# EAGLE design Motor Powerboard Schematic 1A (EAGLE 8.3.2)
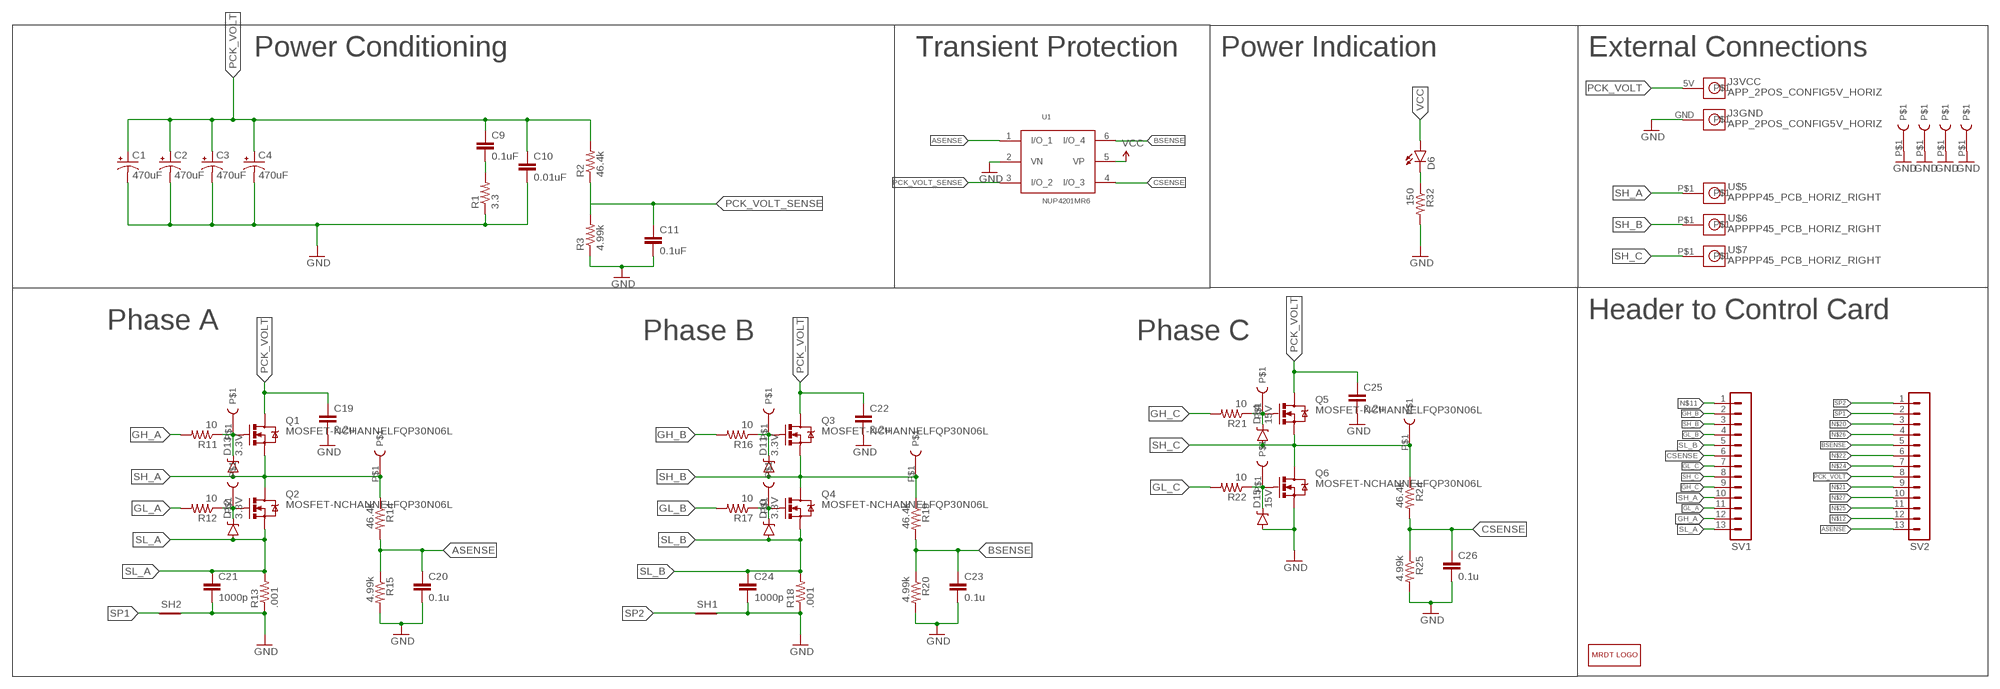
[diagram p0: schematic, sheet 1]

## Parts
C1  470uF  CAP_POLPTH4  [CPOL-RADIAL-1000UF-25V]
C2  470uF  CAP_POLPTH4  [CPOL-RADIAL-1000UF-25V]
C3  470uF  CAP_POLPTH4  [CPOL-RADIAL-1000UF-25V]
C4  470uF  CAP_POLPTH4  [CPOL-RADIAL-1000UF-25V]
C9  0.1uF  CAP0805  [0805]
C10  0.01uF  CAP0805  [0805]
C11  0.1uF  CAP0805  [0805]
C19  2.2u  CAP1206  [1206]
C20  0.1u  CAP0805  [0805]
C21  1000p  CAP0805  [0805]
C22  2.2u  CAP1206  [1206]
C23  0.1u  CAP0805  [0805]
C24  1000p  CAP0805  [0805]
C25  2.2u  CAP1206  [1206]
C26  0.1u  CAP0805  [0805]
D6  LED1206  [LED-1206]
D10  3.3V  DIODE-ZENER3.3V  [SOD-323]
D11  3.3V  DIODE-ZENER3.3V  [SOD-323]
D12  3.3V  DIODE-ZENER3.3V  [SOD-323]
D13  3.3V  DIODE-ZENER3.3V  [SOD-323]
D14  15V  DIODE-ZENER3.3V  [SOD-323]
D15  15V  DIODE-ZENER3.3V  [SOD-323]
J3  APP_2POS_CONFIG5V_HORIZ  [APP45_5V_HORIZ_CONFIG]
LOGO1  MRDT_LOGO  [MRDT_LOGO]
Q1  MOSFET-NCHANNELFQP30N06L  [TO220V]
Q2  MOSFET-NCHANNELFQP30N06L  [TO220V]
Q3  MOSFET-NCHANNELFQP30N06L  [TO220V]
Q4  MOSFET-NCHANNELFQP30N06L  [TO220V]
Q5  MOSFET-NCHANNELFQP30N06L  [TO220V]
Q6  MOSFET-NCHANNELFQP30N06L  [TO220V]
R1  3.3  RESISTOR1206  [1206]
R2  46.4k  RESISTOR0805-RES  [0805]
R3  4.99k  RESISTOR0805-RES  [0805]
R11  10  RESISTOR0805-RES  [0805]
R12  10  RESISTOR0805-RES  [0805]
R13  .001  RESISTOR1206  [1206]
R14  46.4k  RESISTOR0805-RES  [0805]
R15  4.99k  RESISTOR0805-RES  [0805]
R16  10  RESISTOR0805-RES  [0805]
R17  10  RESISTOR0805-RES  [0805]
R18  .001  RESISTOR1206  [1206]
R19  46.4k  RESISTOR0805-RES  [0805]
R20  4.99k  RESISTOR0805-RES  [0805]
R21  10  RESISTOR0805-RES  [0805]
R22  10  RESISTOR0805-RES  [0805]
R24  46.4k  RESISTOR0805-RES  [0805]
R25  4.99k  RESISTOR0805-RES  [0805]
R32  150  RESISTOR0805-RES  [0805]
SH1  SHORT-HT5  [SHORT_TOP-50]
SH2  SHORT-HT5  [SHORT_TOP-50]
SV1  MA13-1  [MA13-1]
SV2  MA13-1  [MA13-1]
U1  NUP4201MR6  [TSOP-6]
U$5  APPPP45_PCB_HORIZ_RIGHT  [APP45_PCB_HORIZ_RIGHT]
U$6  APPPP45_PCB_HORIZ_RIGHT  [APP45_PCB_HORIZ_RIGHT]
U$7  APPPP45_PCB_HORIZ_RIGHT  [APP45_PCB_HORIZ_RIGHT]
U$12  TEST_POINT_0.1INDIAM  [TEST_POINT_0.1INDIAM]
U$15  TEST_POINT_0.1INDIAM  [TEST_POINT_0.1INDIAM]
U$16  TEST_POINT_0.1INDIAM  [TEST_POINT_0.1INDIAM]
U$17  TEST_POINT_0.1INDIAM  [TEST_POINT_0.1INDIAM]
U$18  TEST_POINT_0.1INDIAM  [TEST_POINT_0.1INDIAM]
U$19  TEST_POINT_0.1INDIAM  [TEST_POINT_0.1INDIAM]
U$20  TEST_POINT_0.1INDIAM  [TEST_POINT_0.1INDIAM]
U$24  TEST_POINT_0.1INDIAM  [TEST_POINT_0.1INDIAM]
U$25  TEST_POINT_0.1INDIAM  [TEST_POINT_0.1INDIAM]
U$26  TEST_POINT_0.1INDIAM  [TEST_POINT_0.1INDIAM]
U$27  TEST_POINT_0.1INDIAM  [TEST_POINT_0.1INDIAM]
U$28  TEST_POINT_0.1INDIAM  [TEST_POINT_0.1INDIAM]
U$29  TEST_POINT_0.1INDIAM  [TEST_POINT_0.1INDIAM]

## Nets
ASENSE: C20.1 R14.2 R15.1 SV2.13 U1.1(I/O_1)
BSENSE: C23.1 R19.2 R20.1 SV2.5 U1.6(I/O_4)
CSENSE: C26.1 R24.2 R25.1 SV1.6 U1.4(I/O_3)
GH_A: R11.2 SV1.12
GH_B: R16.2 SV1.2
GH_C: R21.2 SV1.9
GL_A: R12.2 SV1.11
GL_B: R17.2 SV1.4
GL_C: R22.2 SV1.7
GND: C1.2(-) C2.2(-) C3.2(-) C4.2(-) C10.2 C11.2 C19.2 C20.2 C21.2 C22.2 C23.2 C24.2 C25.2 C26.2 D15.A J3.GND Q6.3(S) R1.1 R3.1 R13.1 R15.2 R18.1 R20.2 R25.2 R32.2 SH1.2 SH2.2 U1.2(VN) U$26.P$1 U$27.P$1 U$28.P$1 U$29.P$1
N$1: C9.2 R1.2
N$11: SV1.1
N$12: SV2.12
N$13: D13.C Q1.1(G) R11.1 U$12.P$1
N$14: D11.C Q3.1(G) R16.1 U$16.P$1
N$15: D10.C Q4.1(G) R17.1 U$17.P$1
N$16: D12.C Q2.1(G) R12.1 U$15.P$1
N$17: D14.C Q5.1(G) R21.1 U$18.P$1
N$18: D15.C Q6.1(G) R22.1 U$19.P$1
N$20: SV2.3
N$21: SV2.9
N$22: SV2.6
N$23: D6.C R32.1
N$24: SV2.7
N$25: SV2.11
N$26: SV2.4
N$27: SV2.10
PCK_VOLT: C1.1(+) C2.1(+) C3.1(+) C4.1(+) C9.1 C10.1 C19.1 C22.1 C25.1 J3.5V Q1.2(D) Q3.2(D) Q5.2(D) R2.2 SV2.8
PCK_VOLT_SENSE: C11.1 R2.1 R3.2 U1.3(I/O_2)
SH_A: D13.A Q1.3(S) Q2.2(D) R14.1 SV1.10 U$5.P$1 U$25.P$1
SH_B: D11.A Q3.3(S) Q4.2(D) R19.1 SV1.3 U$6.P$1 U$24.P$1
SH_C: D14.A Q5.3(S) Q6.2(D) R24.1 SV1.8 U$7.P$1 U$20.P$1
SL_A: C21.1 D12.A Q2.3(S) R13.2 SV1.13
SL_B: C24.1 D10.A Q4.3(S) R18.2 SV1.5
SP1: SH2.1 SV2.2
SP2: SH1.1 SV2.1
VCC: D6.A U1.5(VP)

## Notes on the sheet
- Power Conditioning | Transient Protection | Power Indication | External Connections
- Header to Control Card
- Phase A
- Phase B | Phase C

## Library data of the parts
C1-C4 = SparkFun-Passives:CAP_POL: Capacitor Polarized These are standard SMD and PTH capacitors. Normally 10uF, 47uF, and 100uF in electrolytic and tantalum varieties. Always verify the external diameter of the through hole cap, it varies with capacity, voltage, and manufacturer. The EIA devices should be standard.
C9-C11 C19-C26 = SparkFun-Passives:CAP: Capacitor Standard 0603 ceramic capacitor, and 0.1" leaded capacitor.
D6 = SparkFun-LED:LED: LEDs Standard schematic elements and footprints for 5mm, 3mm, 1206, and 0603 sized LEDs. 5mm - Spark Fun Electronics SKU : COM-00529 (and others)
D10-D13 = SparkFun-DiscreteSemi:DIODE-ZENER: Zener Diode Production Part - 8199 3.4V Zener Voltage; PROD_ID: DIO-11284
D14 D15 = SparkFun-DiscreteSemi:DIODE-ZENER: Zener Diode Production Part - 8199 3.4V Zener Voltage; PROD_ID: DIO-11284; VALUE: 3.3V
J3 = MRDT-Connectors:APP_2POS_CONFIG; COLOR1: RED; COLOR2: BLACK
LOGO1 = MRDT-Hardware:MRDT_LOGO
Q1-Q6 = SparkFun-DiscreteSemi:MOSFET-NCHANNEL: Common NMOSFET Parts MFG P/N Store ID Prod ID FDD8780 TRANS-09984 SI7820DN TRANS-11055 FDS6630A IC-08089 2N7002PW TRANS-11151 FQP30N06L COM-10213 TRANS-10060 BSS123LT1G TRANS-08345 BSS138 TRANS-00830 BS170 2N7000; PROD_ID: TRANS-10060
R1-R3 R11-R22 R24 R25 R32 = SparkFun-Passives:RESISTOR: Resistor Basic schematic elements and footprints for 0603, 1206, and PTH resistors.
SH1 SH2 = BLDC_Motor_Controller_2016_Rev1:SHORT-H: Short between two nets; BOM: no
SV1 SV2 = con-lstb:MA13-1: PIN HEADER; OC_FARNELL: unknown; OC_NEWARK: unknown
U1 = MRDT-ICs:NUP4201MR6
U$5-U$7 = MRDT-Connectors:APP: http://www.powerwerx.com/anderson-powerpoles/
U$12 U$15-U$20 U$24-U$29 = MRDT-Connectors:TEST_POINT_0.1INDIAM

## Board
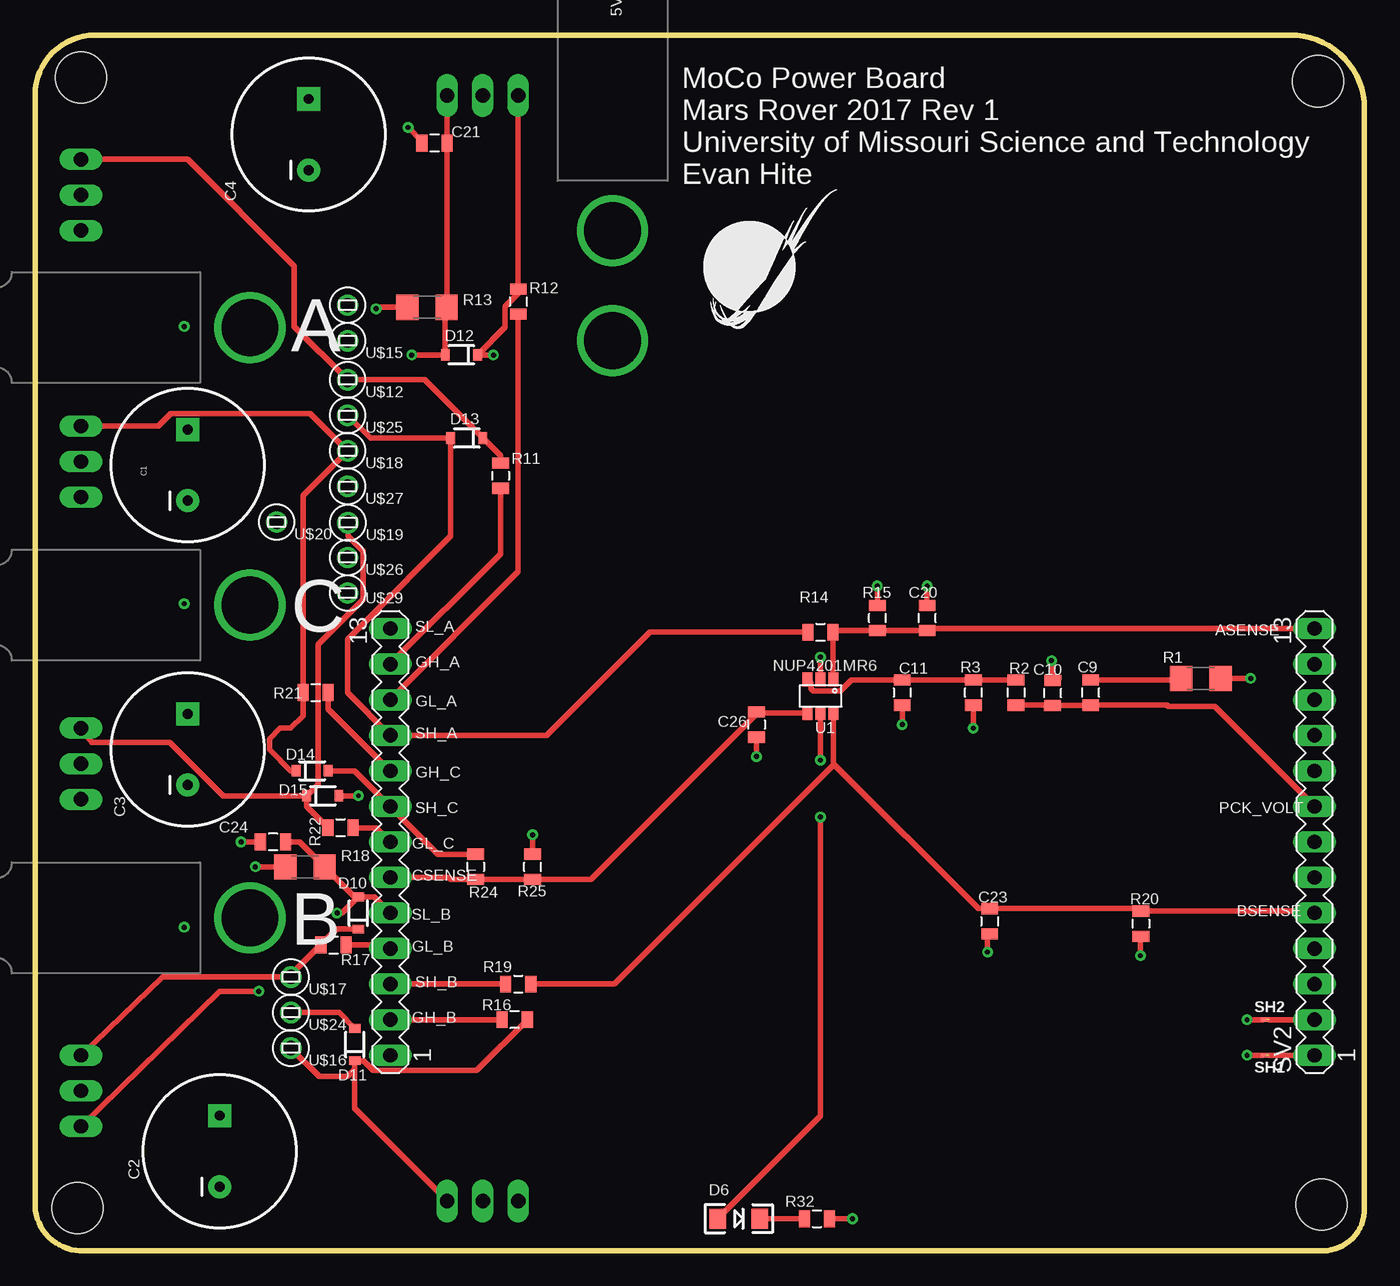
[diagram p1: board, top side]
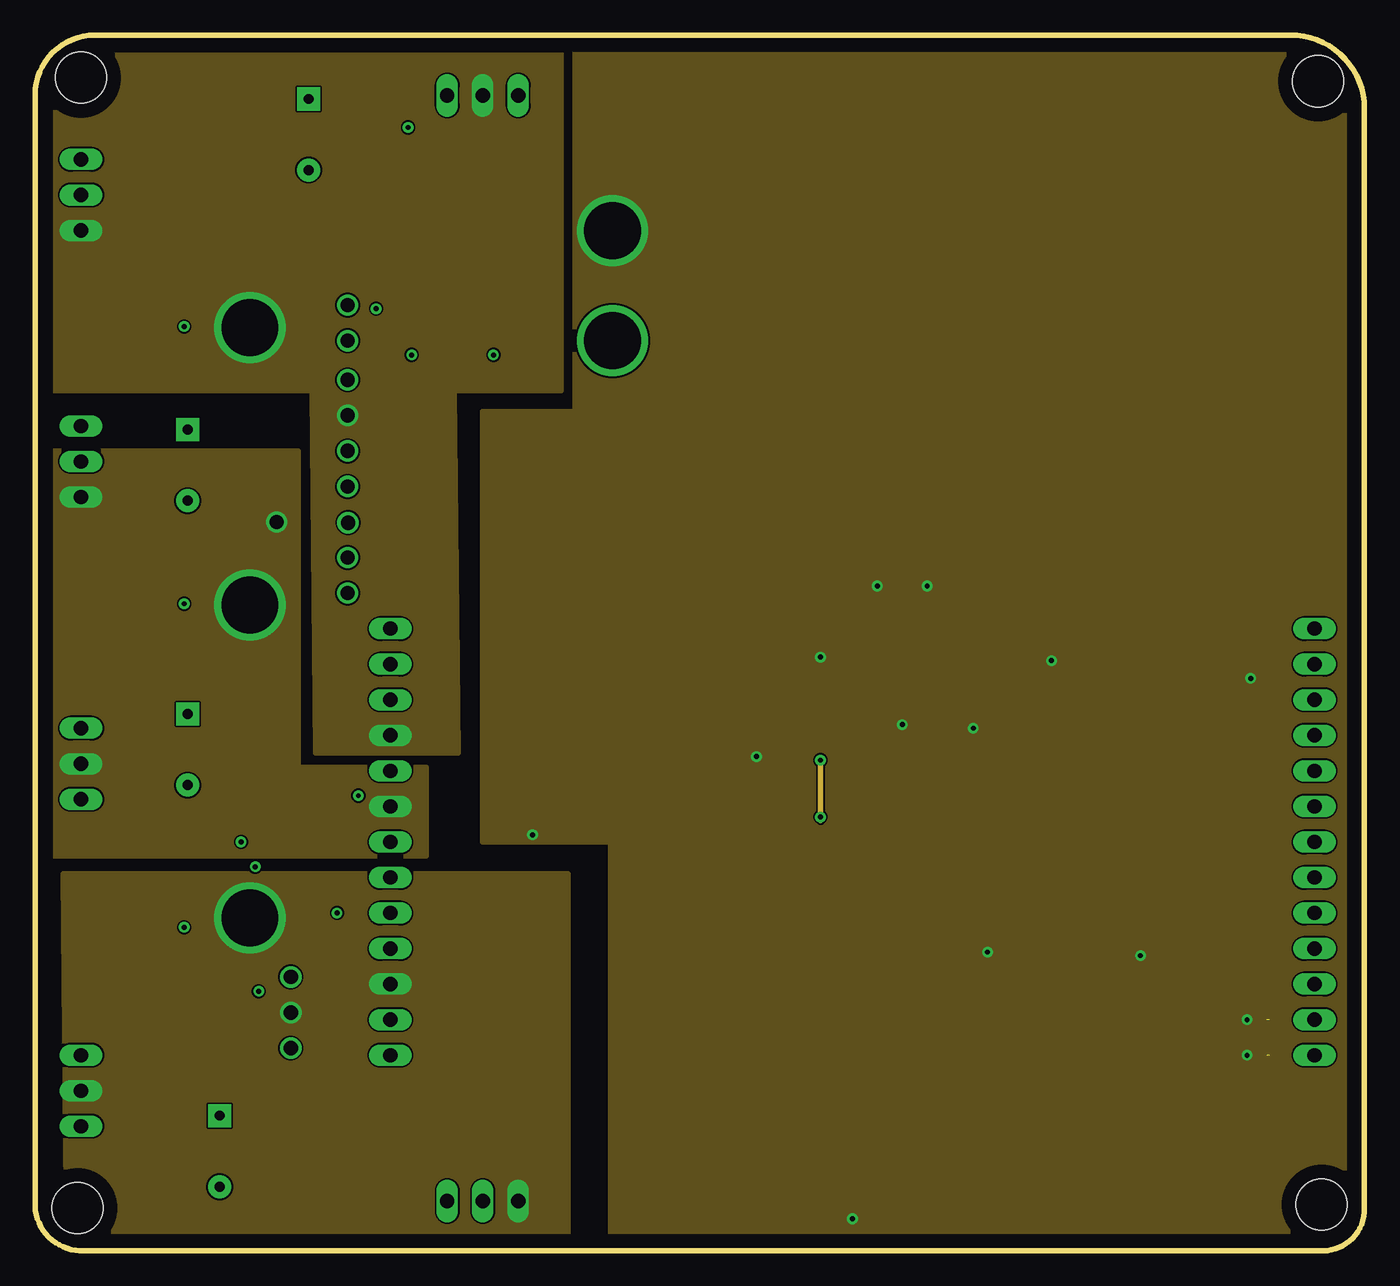
[diagram p2: board, inner layer Route2]
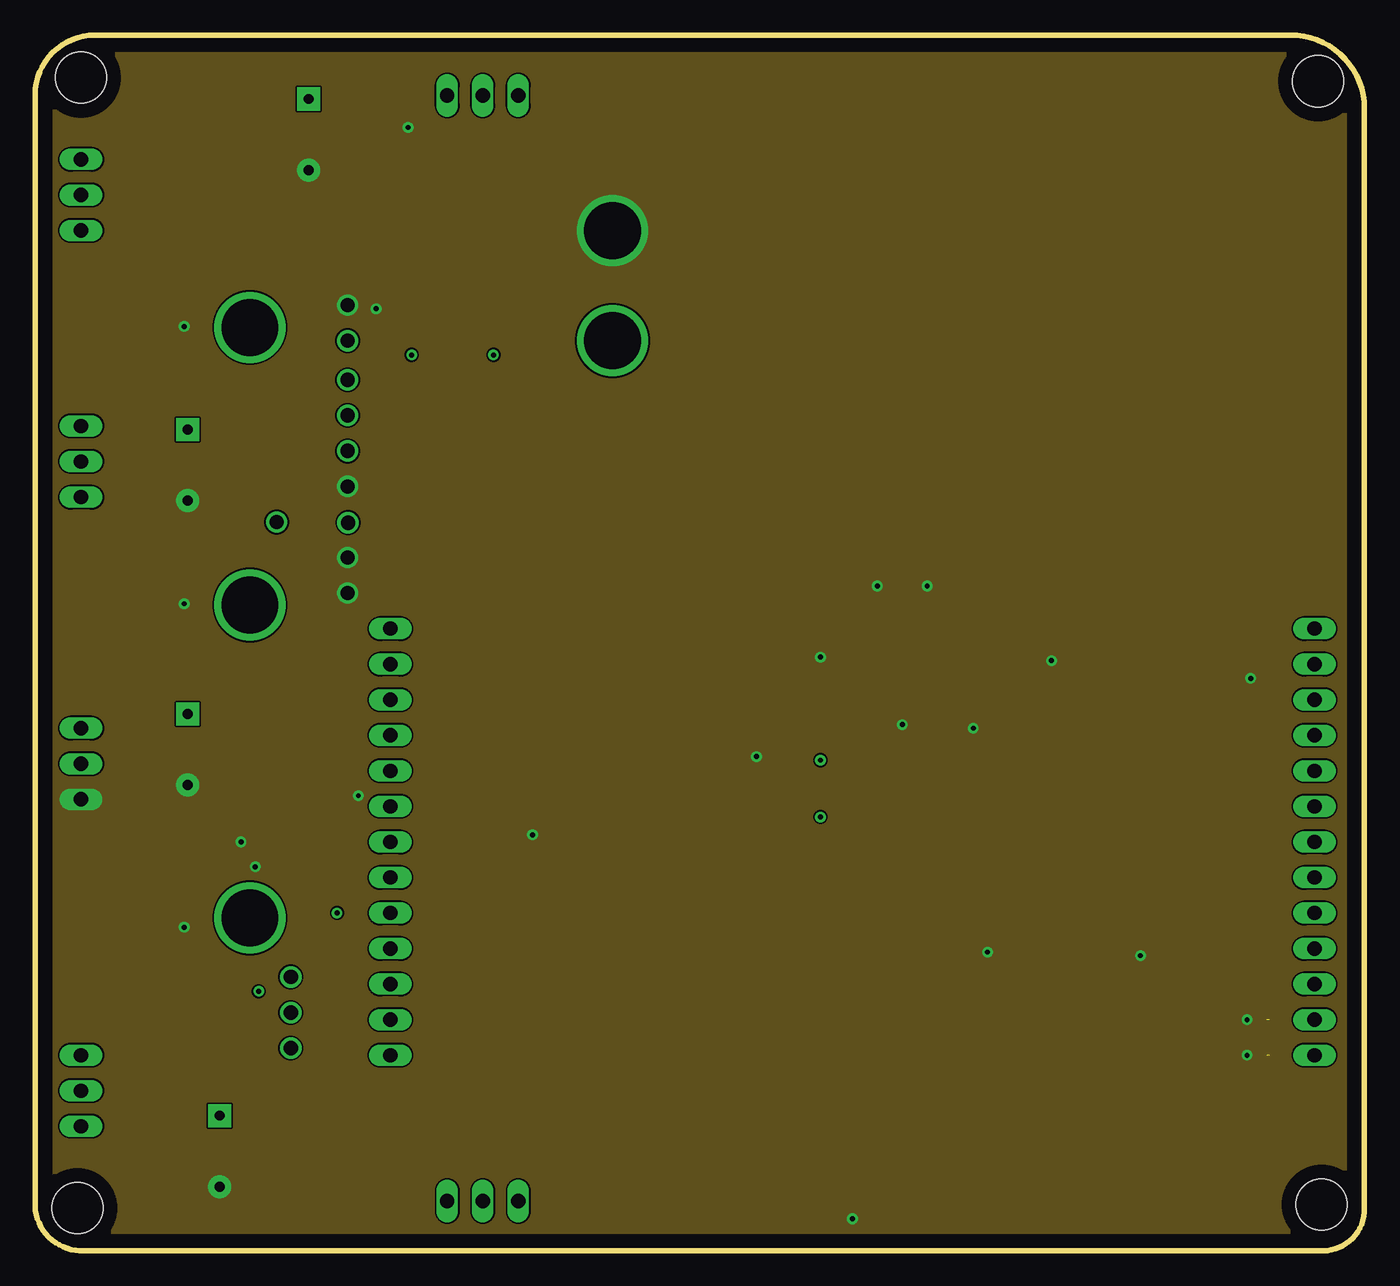
[diagram p3: board, inner layer Route15]
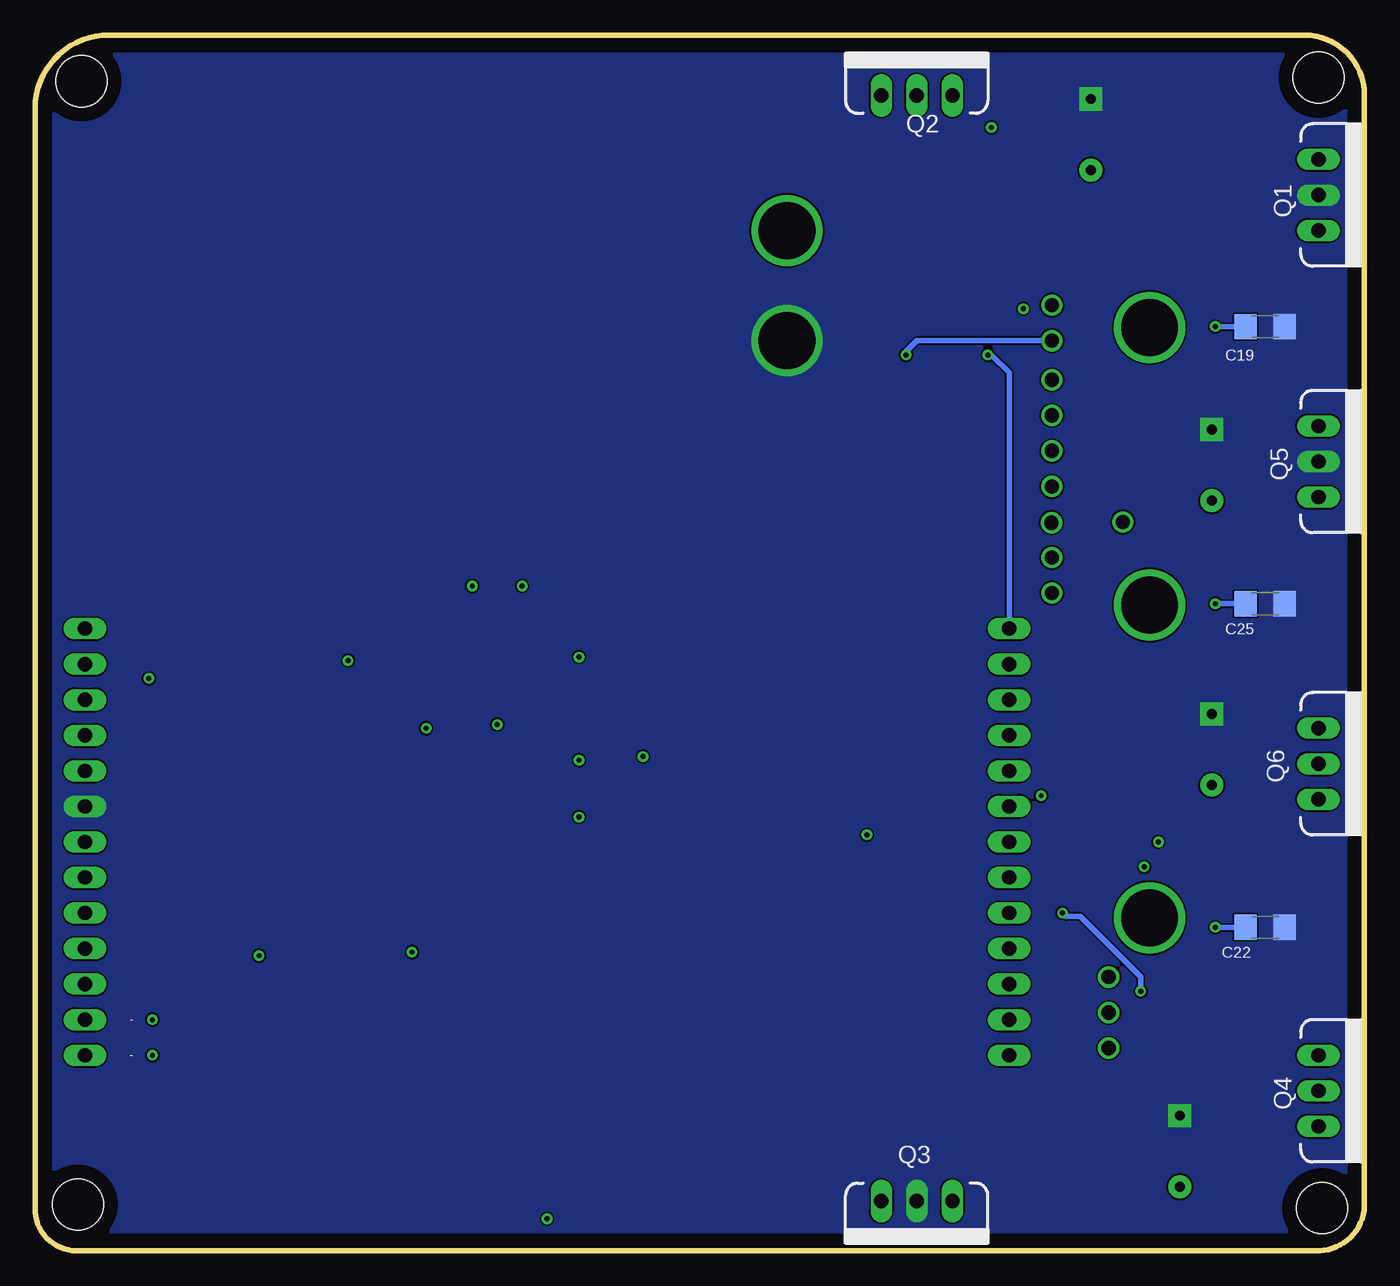
[diagram p4: board, bottom side, seen from below]

Size 95 x 86.88 mm. Coordinates in mm from the lower left corner, seen from the top.
Outline: 48.78,86.88 4.28,86.88 arc90 0,82.61 0,3.5 arc90 3.21,0.01 91.75,0.01 arc90 95,2.75 95,81.62 arc90 89.68,86.88 48.78,86.88
Copper layers (1*2*15*16): Top 0.035mm / dielectric 1.5mm / Route2 0.035mm / dielectric 0.15mm / Route15 0.035mm / dielectric 0.2mm / Bottom 0.035mm
Design rules "advanced_circuits_standard *": minimum track width 5mil, minimum drill 10mil, track to track 5mil, track to pad 5mil, pad to pad 5mil, via to via 5mil, smd to smd 5mil, copper to edge 40mil, drill to drill 5mil, minimum pad ring 10mil, minimum via ring 8mil, stop-mask expansion 4mil, vias tented up to drill 0mil, thermal gap 10mil
Holes 3.66 mm at 3.29,83.83 91.68,83.58 3.04,3.06 91.94,3.31

### Footprints (pad centres in the part's own frame; a part is rotated, then mirrored left to right if it is on the bottom)
CPOL-RADIAL-1000UF-25V = drill 0.7 pad 1.651 square: 1 2.54,0 | drill 0.7 pad 1.651: 2 -2.54,0
0805 = smd 0.8 x 1.2: 1 -0.9,0; 2 0.9,0
1206 = smd 1.6 x 1.8: 1 -1.4,0; 2 1.4,0
LED-1206 = smd 1.2 x 1.4: A -1.5,0; C 1.5,0
SOD-323 = smd 0.63 x 0.83: A 1.15,0; C -1.15,0
APP45_5V_HORIZ_CONFIG = drill 4.064: 5V 36.068,3.937; GND 28.194,3.937
TO220V = drill 1.016 long: 1 -2.54,0; 2 0,0; 3 2.54,0
SHORT_TOP-50 = smd 0.305 x 0.305: 1 0.152,0; 2 -0.152,0
MA13-1 = drill 1.016 long: 1 -15.24,0; 2 -12.7,0; 3 -10.16,0; 4 -7.62,0; 5 -5.08,0; 6 -2.54,0; 7 0,0; 8 2.54,0; 9 5.08,0; 10 7.62,0; 11 10.16,0; 12 12.7,0; 13 15.24,0
TSOP-6 = smd 0.991 x 0.711: 1 -1.194,0.94; 2 -1.194,0; 3 -1.194,-0.94; 4 1.194,-0.94; 5 1.194,0; 6 1.194,0.94
APP45_PCB_HORIZ_RIGHT = drill 4.064: P$1 28.194,3.969
TEST_POINT_0.1INDIAM = drill 1.016: P$1 0,0

### Placement (x,y rotation side)
C1  10.91,56.14 90 top
C2  13.2,7.12 90 top
C3  10.91,35.82 90 top
C4  19.55,79.77 90 top
C9  75.43,39.89 90 top
C10  72.71,39.86 89.6 top
C11  61.97,39.89 270 top
C19  7.1,66.05 180 bottom
C20  63.74,45.22 90 top
C21  28.54,79.16 180 top
C22  7.1,23.12 180 bottom
C23  68.21,23.56 270 top
C24  17.01,29.22 180 top
C25  7.1,46.24 180 bottom
C26  51.55,37.6 270 top
D6  50.28,2.3 0 top
D10  23.1,24.14 90 top
D11  22.85,14.74 90 top
D12  30.47,64.02 180 top
D13  30.85,58.07 180 top
D14  19.8,34.3 0 top
D15  20.56,32.52 0 top
J3  37.33,101.1 270 top
LOGO1  47.74,65.03 0 top
Q1  3.29,75.45 270 bottom
Q2  31.99,82.56 0 bottom
Q3  31.99,3.57 180 bottom
Q4  3.29,11.44 270 bottom
Q5  3.29,56.4 270 bottom
Q6  3.29,34.81 270 bottom
R1  83.3,40.9 180 top
R2  70.09,39.89 270 top
R3  67.05,39.89 90 top
R11  33.26,55.38 270 top
R12  34.53,67.83 270 top
R13  28.01,67.42 0 top
R14  56.12,44.21 0 top
R15  60.19,45.22 90 top
R16  34.28,16.52 180 top
R17  21.33,21.85 0 top
R18  19.29,27.44 0 top
R19  34.53,19.06 0 top
R20  79.01,23.38 270 top
R21  20.06,39.89 0 top
R22  21.83,30.24 0 top
R24  31.49,27.44 270 top
R25  35.55,27.44 90 top
R32  55.87,2.3 0 top
SH1  87.87,13.98 0 top
SH2  87.87,16.52 0 top
SV1  25.39,29.22 90 top
SV2  91.43,29.22 90 top
U1  56.12,39.63 270 top
U$5  -12.84,62.01 0 top
U$6  -12.84,19.82 0 top
U$7  -12.84,42.17 0 top
U$12  22.34,62.24 0 top
U$15  22.34,65.03 0 top
U$16  18.28,14.49 0 top
U$17  18.28,19.57 0 top
U$18  22.34,57.16 0 top
U$19  22.37,52.03 0 top
U$20  17.26,52.08 0 top
U$24  18.28,17.03 0 top
U$25  22.34,59.7 0 top
U$26  22.34,49.54 0 top
U$27  22.34,54.62 0 top
U$28  22.34,67.57 0 top
U$29  22.34,47 0 top

### Tracks (layer width: path | path; a pad name or v marks a point on that pad's centre or on a via)
ASENSE
  Top 0.406: SV2.13 63.61,44.46 C20.1 R15.1 57.16,44.34 R14.2 57.02,40.87 U1.1
BSENSE
  Top 0.406: 57.06,34.81 U1.6 | 57.06,34.81 57.06,34.73 41.39,19.06 R19.2 | 57.06,34.81 67.42,24.46 C23.1 78.83,24.46 R20.1 91.29,24.28 SV2.5
CSENSE
  Top 0.406: SV1.6 29.57,26.68 29.71,26.54 R24.2 R25.1 39.72,26.54 51.61,38.44 | 51.61,38.44 U1.4 | 51.61,38.44 C26.1
GH_A
  Top 0.406: R11.2 33.26,49.79 SV1.12
GH_B
  Top 0.406: R16.2 SV1.2
GH_C
  Top 0.406: R21.2 20.96,38.73 SV1.9
GL_A
  Top 0.406: R12.2 34.53,48.52 SV1.11
GL_B
  Top 0.406: R17.2 25.14,21.85 SV1.4
GL_C
  Top 0.406: R22.2 24.37,30.24 SV1.7
GND  (via drill 0.35)
  Top 0.406: SH2.2 v86.6,16.52 | SH1.2 v86.6,13.98 | C24.2 v14.72,29.22 | R18.1 v15.74,27.44 | R15.2 v60.19,47.51 | C20.2 v63.74,47.51 | C11.2 v61.97,37.6 | C26.2 v51.55,35.32 | U1.2 v56.12,42.43 | v68.06,21.35 68.06,22.5 C23.2 | v78.98,21.09 78.98,22.45 R20.2 | R1.1 v86.86,40.9 | C10.2 72.72,42.09 v72.63,42.17 | v67.05,37.35 R3.1 | R13.1 24.48,67.42 v24.37,67.32 | D15.A v23.1,32.52 | R25.2 v35.55,29.73 | C21.2 27.64,79.29 v26.66,80.27 | v58.41,2.3 R32.2
  Bottom 0.406: v10.66,23.12 C22.2 | v10.66,46.24 C25.2 | v10.66,66.05 C19.2
  pour Route15 (no thermals): -1.03,87.64 98.8,87.39 98.8,-2.02 -1.53,-2.02
  pour Route2 (no thermals): 38.6,87.89 38.6,59.95 31.99,59.95 31.99,29.22 41.14,29.22 41.14,-2.28 99.05,-2.28 99.05,87.89
N$1
  Top 0.406: C9.2 81.26,40.79 R1.2
N$13
  Top 0.406: Q1.1 10.91,77.99 18.53,70.37 18.53,66.05 U$12.P$1 27.83,62.24 D13.C 33.26,56.81 R11.1
N$14
  Top 0.406: D11.C 22.85,12.96 22.34,12.46 20.31,12.46 U$16.P$1 | D11.C 23.47,13.59 24.18,12.89 31.55,12.89 R16.1 | D11.C 22.85,10.17 Q3.1
N$15
  Top 0.406: D10.C 21.56,22.99 R17.1 18.28,19.71 U$17.P$1 9.13,19.57 Q4.1
N$16  (via drill 0.35)
  Top 0.406: Q2.1 R12.1 34.53,68.4 33.6,67.47 33.6,66 D12.C v32.76,64.02
  Bottom 0.406: U$15.P$1 31.99,65.03 32.76,64.27 v32.76,64.02
N$17
  Top 0.406: Q5.1 8.79,58.94 9.7,59.84 19.66,59.84 U$18.P$1 19.16,53.97 R21.1 19.16,38.23 18.28,37.35 17.52,37.35 16.75,36.59 16.75,35.82 18.28,34.3 D14.C
N$18
  Top 0.406: R22.1 19.41,31.76 D15.C | U$19.P$1 22.37,51.06 23.43,49.99 23.43,46.55 20.23,43.34 20.23,33.33 D15.C | Q6.1 4.05,36.33 9.64,36.33 13.45,32.52 D15.C
N$23
  Top 0.406: D6.C R32.1
PCK_VOLT
  Top 0.406: R2.2 72.68,38.99 C10.1 75.4,38.96 C9.1 80.89,38.99 80.99,38.88 84.31,38.88 SV2.8
  pour Bottom (no thermals): -2.3,88.66 99.56,88.91 99.56,-2.78 -2.3,-2.78
PCK_VOLT_SENSE
  Top 0.406: U1.3 55.44,40.57 55.44,40.2 55.63,40 57.56,40 58.34,40.79 C11.1 R3.2 R2.1
SH_A
  Top 0.406: R14.1 43.93,44.21 36.57,36.84 SV1.10 22.34,39.89 22.34,43.7 23.54,44.89 23.54,44.91 29.7,51.08 D13.A 23.97,58.07 U$25.P$1
  pour Route2 (no thermals): 1.01,61.48 19.8,61.48 20.06,35.57 30.22,35.57 29.96,61.48 37.58,61.48 37.58,85.86 1.01,85.86
SH_B
  Top 0.406: R19.1 SV1.3 | U$24.P$1 21.71,17.03 D11.A
  pour Route2 (no thermals): 38.09,0.52 38.09,26.93 2.02,26.93 2.28,0.26
SH_C
  Top 0.406: R24.1 28.81,28.34 SV1.8 22.85,34.3 D14.A
  pour Route2 (no thermals): 1.01,57.16 18.79,57.16 18.79,34.55 27.93,34.55 27.93,28.2 1.01,28.2
SL_A  (via drill 0.35)
  Top 0.406: Q2.3 C21.1 29.44,67.83 | 29.44,67.83 29.44,67.46 R13.2 | 29.44,67.83 29.32,67.71 D12.A v26.91,64.02
  Bottom 0.406: SV1.13 25.39,62.75 26.66,64.02 v26.91,64.02
SL_B  (via drill 0.35)
  Top 0.406: v21.58,24.14 21.95,24.14 D10.A | D10.A 22.85,25.29 R18.2 18.92,29.22 C24.1 | D10.A 24.24,25.29 SV1.5 | v15.99,18.55 13.2,18.55 Q4.3
  Bottom 0.406: v15.99,18.55 15.99,19.57 20.31,23.89 21.33,23.89 v21.58,24.14
SP1  (1 unrouted)
  Top 0.406: SV2.2 88.2,16.52
SP2  (1 unrouted)
  Top 0.406: SV2.1 88.2,13.98
VCC  (via drill 0.35)
  Top 0.406: U1.5 v56.12,35.06 | v56.12,31 56.12,9.64 D6.A
  Route2 0.406: v56.12,35.06 v56.12,31 | v56.12,31 56.12,30.74 v56.12,31

### Text on the board
tPlace: MoCo Power Board / Mars Rover 2017 Rev 1 / University of Missouri Science and Technology / Evan Hite | A | C | SL_A | ASENSE | GH_A | GL_A | SH_A | GH_C | SH_C | PCK_VOLT | GL_C | CSENSE | SL_B | BSENSE | B | GL_B | SH_B | GH_B